# EAGLE design LED Breakout Board V8 (EAGLE 7.1.0)
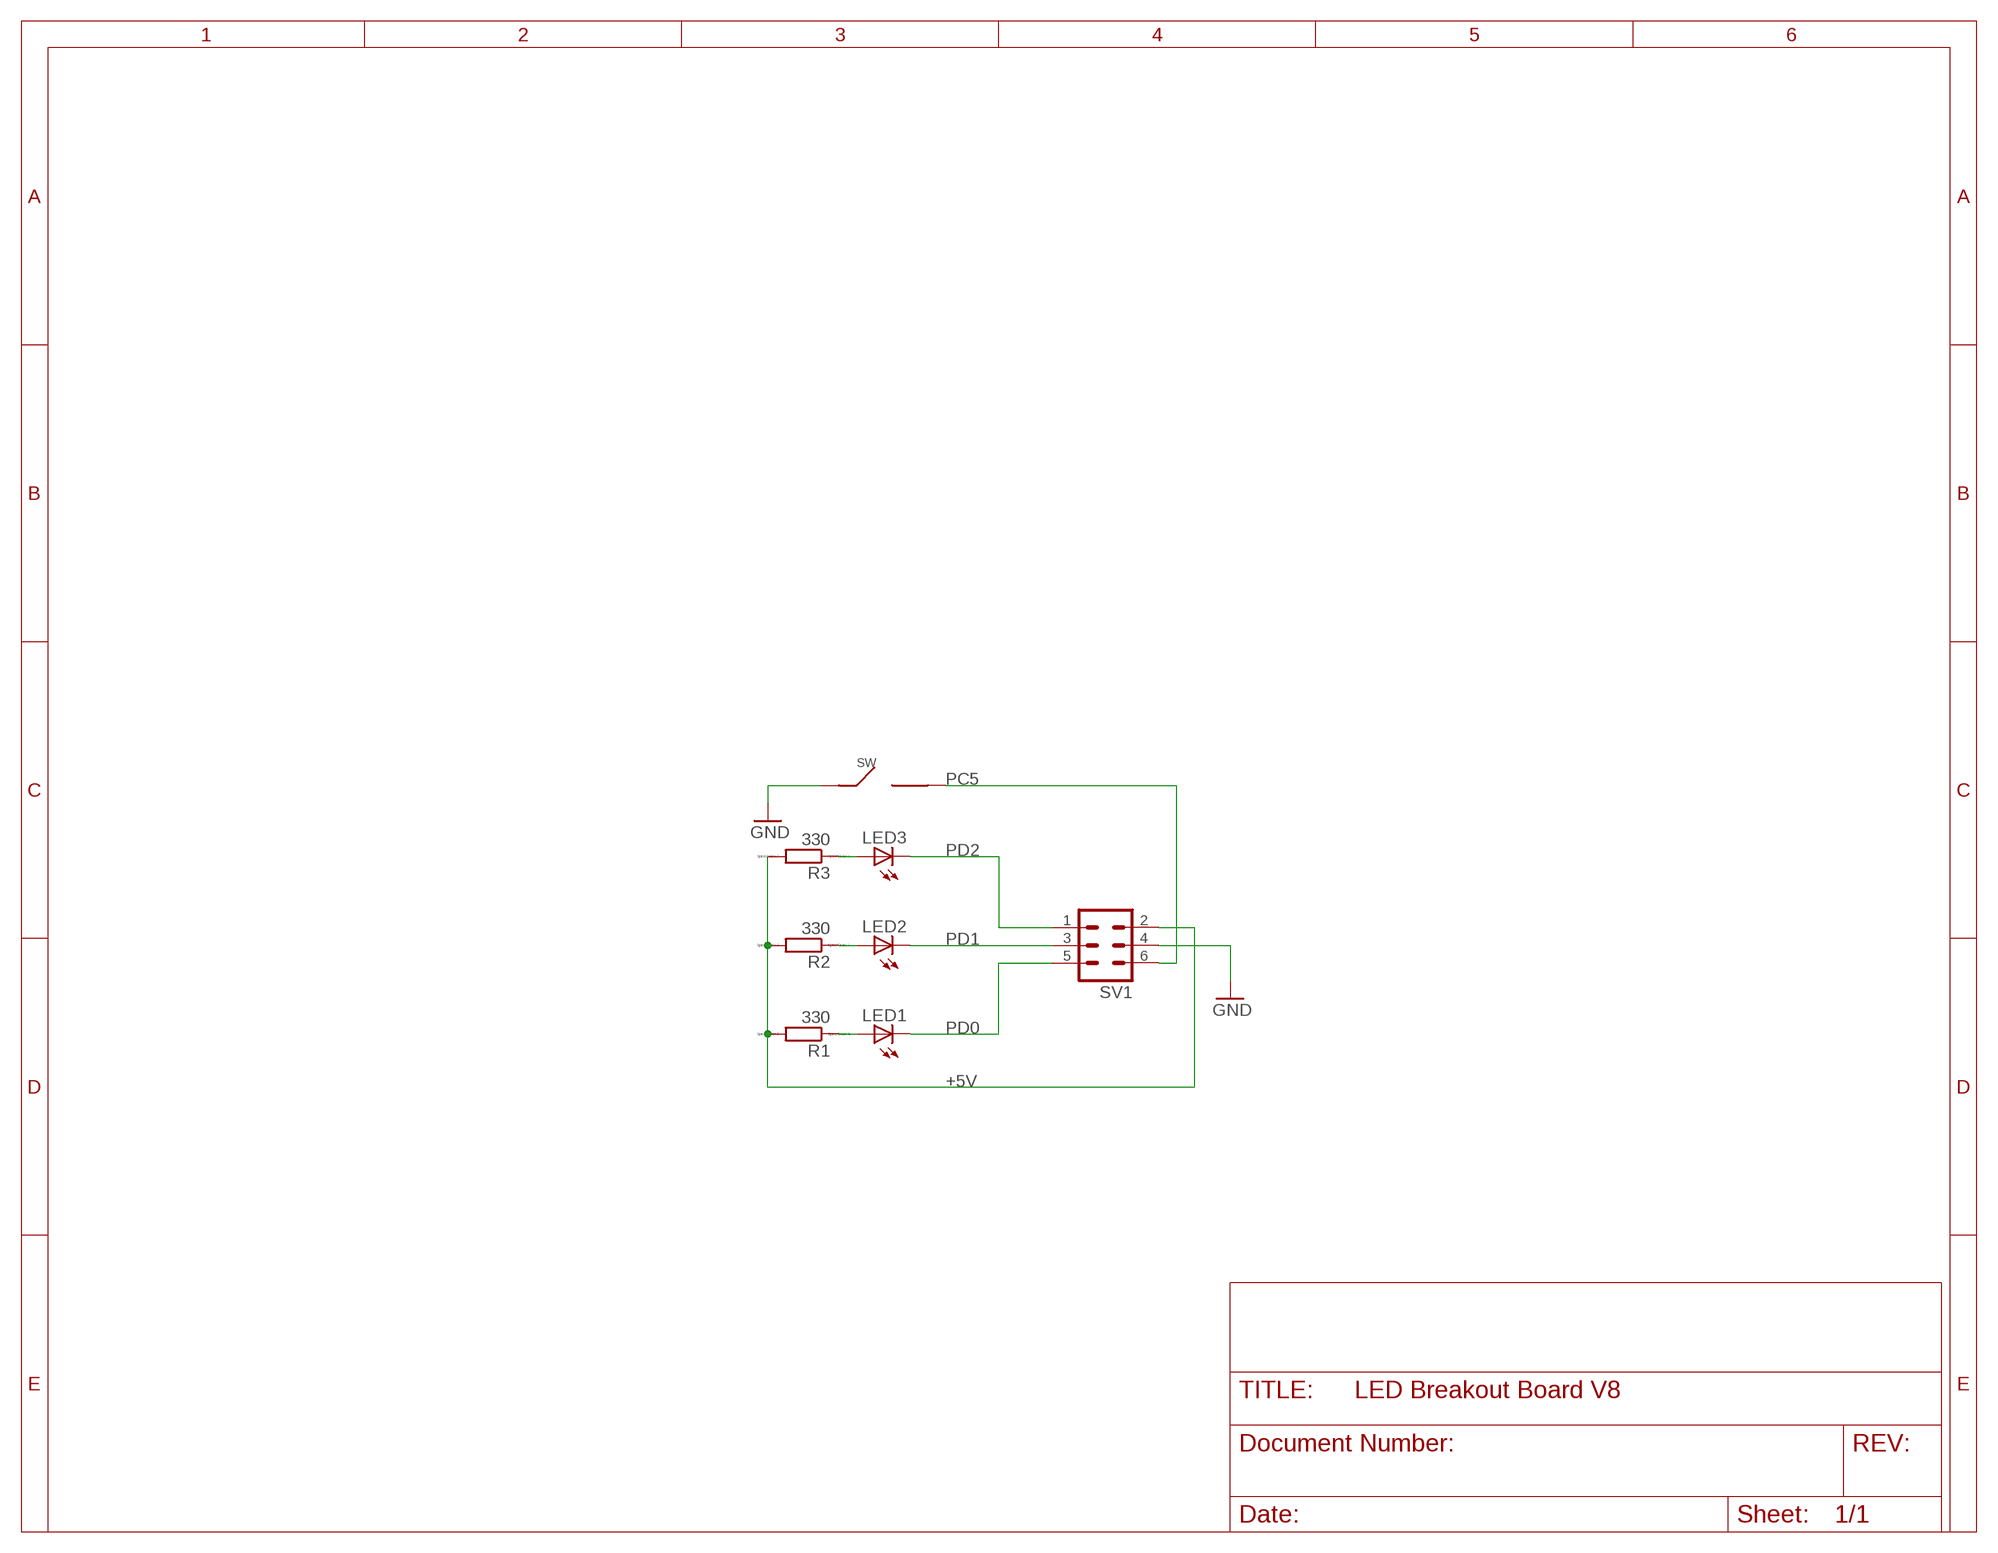
[diagram p0: schematic, sheet 1]

## Parts
LED1  LED10MM  [LED10MM]
LED2  LED10MM  [LED10MM]
LED3  LED10MM  [LED10MM]
R1  330  R0207/10  [0207/10]
R2  330  R0207/10  [0207/10]
R3  330  R0207/10  [0207/10]
SV1  MA03-2  [MA03-2]
SW  PUSHBUTTON  [PUSHBUTTON]

## Nets
+5V: R1.2 R2.2 R3.2 SV1.2
GND: SV1.4 SW.IN
N$2: LED3.A R3.1
N$3: LED2.A R2.1
N$4: LED1.A R1.1
PC5: SV1.6 SW.OUT
PD0: LED1.K(C) SV1.5
PD1: LED2.K(C) SV1.3
PD2: LED3.K(C) SV1.1

## Library data of the parts
LED1-LED3 = led:LED: LED OSRAM: - CHIPLED LG R971, LG N971, LY N971, LG Q971, LY Q971, LO R971, LY R971 LH N974, LH R974 LS Q976, LO Q976, LY Q976 LO Q996 - Hyper CHIPLED LW Q18S LB Q993, LB Q99A, LB R99A - SideLED LS A670, LO A670, LY A670, LG A670, LP A670 LB A673, LV A673, LT A673, LW A673 LH A674 LY A675 LS A676, LA A676, LO A676, LY A676, LW A676 LS A679, LY A679, LG A679 - Hyper Micro SIDELED® LS Y876, LA Y876, LO Y876, LY Y876 LT Y87S - SmartLED LW L88C, LW L88S LB L89C, LB L89S, LG L890 LS L89K, LO L89K, LY L89K LS L896, LA L896, LO L896, LY L896 - TOPLED LS T670, LO T670, LY T670, LG T670, LP T670 LSG T670, LSP T670, LSY T670, LOP T670, LYG T670 LG T671, LOG T671, LSG T671 LB T673, LV T673, LT T673, LW T673 LH T674 LS T676, LA T676, LO T676, LY T676, LB T676, LH T676, LSB T676, LW T676 LB T67C, LV T67C, LT T67C, LS T67K, LO T67K, LY T67K, LW E67C LS E67B, LA E67B, LO E67B, LY E67B, LB E67C, LV E67C, LT E67C LW T67C LS T679, LY T679, LG T679 LS T770, LO T770, LY T770, LG T770, LP T770 LB T773, LV T773, LT T773, LW T773 LH T774 LS E675, LA E675, LY E675, LS T675 LS T776, LA T776, LO T776, LY T776, LB T776 LHGB T686 LT T68C, LB T68C - Hyper Mini TOPLED® LB M676 - Mini TOPLED Santana® LG M470 LS M47K, LO M47K, LY M47K Source: http://www.osram.convergy.de LUXEON: - LUMILED® LXK2-PW12-R00, LXK2-PW12-S00, LXK2-PW14-U00, LXK2-PW14-V00 LXK2-PM12-R00, LXK2-PM12-S00, LXK2-PM14-U00 LXK2-PE12-Q00, LXK2-PE12-R00, LXK2-PE12-S00, LXK2-PE14-T00, LXK2-PE14-U00 LXK2-PB12-K00, LXK2-PB12-L00, LXK2-PB12-M00, LXK2-PB14-N00, LXK2-PB14-P00, LXK2-PB14-Q00 LXK2-PR12-L00, LXK2-PR12-M00, LXK2-PR14-Q00, LXK2-PR14-R00 LXK2-PD12-Q00, LXK2-PD12-R00, LXK2-PD12-S00 LXK2-PH12-R00, LXK2-PH12-S00 LXK2-PL12-P00, LXK2-PL12-Q00, LXK2-PL12-R00 Source: www.luxeon.com KINGBRIGHT: KA-3528ASYC Source: www.kingbright.com
R1-R3 = eagle-ltspice:R: RESISTOR, European symbol; SPICEMODEL: NONE; SPICEPREFIX: R
SV1 = con-lstb:MA03-2: PIN HEADER; OC_FARNELL: unknown; OC_NEWARK: unknown
SW = pushbutton:PUSHBUTTON

## Board
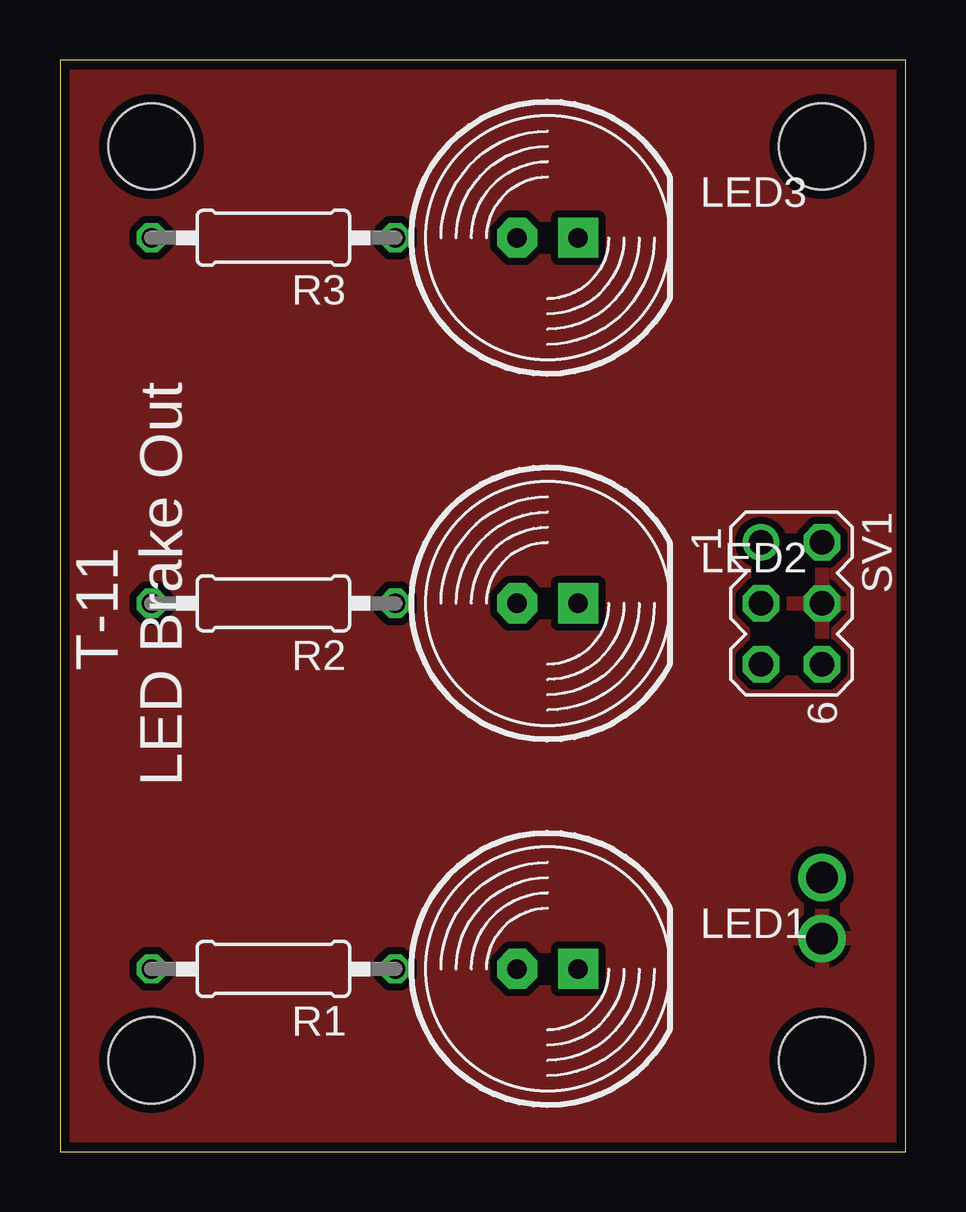
[diagram p1: board, top side]
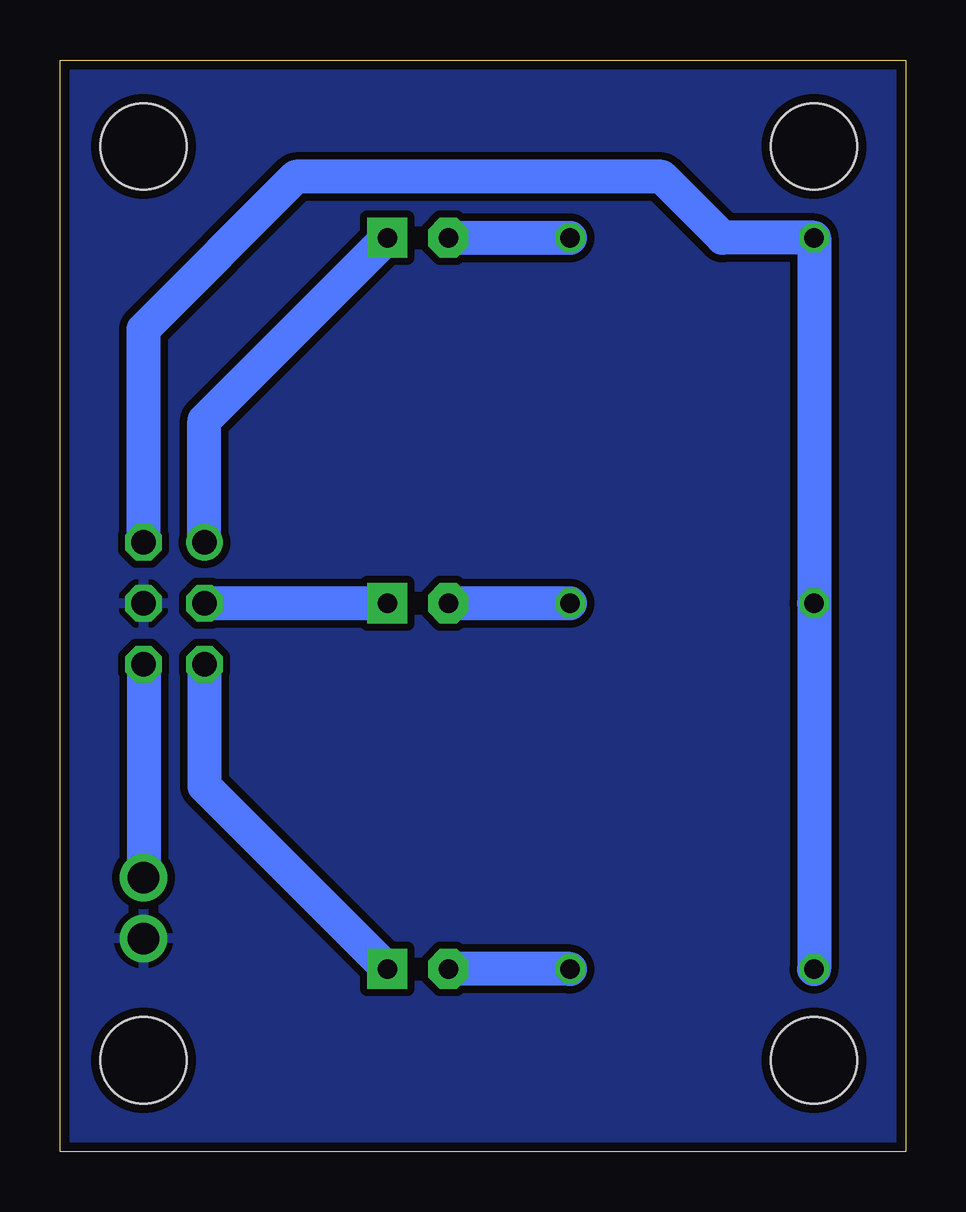
[diagram p2: board, bottom side, seen from below]

Size 35.23 x 45.51 mm. Coordinates in mm from the lower left corner, seen from the top.
Outline: 0,0 35.23,0 35.23,45.51 0,45.51 0,0
Copper layers (1*16): Top 0.0178mm / dielectric 59mil / Bottom 0.0178mm
Design rules "epl-lpkf": minimum track width 8mil, minimum drill 0.35mm, track to track 8mil, track to pad 8mil, pad to pad 8mil, via to via 8mil, smd to smd 8mil, copper to edge 15mil, drill to drill 15mil, minimum pad ring 8mil, minimum via ring 8mil, stop-mask expansion 3mil, vias tented up to drill 0mil, thermal gap 10mil
Holes 3.6 mm at 3.81,41.91 31.75,41.91 31.75,3.81 3.81,3.81

### Footprints (pad centres in the part's own frame; a part is rotated, then mirrored left to right if it is on the bottom)
LED10MM = drill 0.813 pad 1.676 octagon: A -1.27,0 | drill 0.813 pad 1.676 square: K 1.27,0
0207/10 = drill 0.813 octagon: 1 -5.08,0; 2 5.08,0
MA03-2 = drill 1.016: 1 -2.54,-1.27 | drill 1.016 octagon: 2 -2.54,1.27; 3 0,-1.27; 4 0,1.27; 5 2.54,-1.27; 6 2.54,1.27
PUSHBUTTON = drill 1.321: IN -1.27,0; OUT 1.27,0

### Placement (x,y rotation side)
LED1  20.32,7.62 0 top
LED2  20.32,22.86 0 top
LED3  20.32,38.1 0 top
R1  8.89,7.62 180 top
R2  8.89,22.86 180 top
R3  8.89,38.1 180 top
SV1  30.48,22.86 270 top
SW  31.75,10.16 90 top

### Tracks (layer width: path | path; a pad name or v marks a point on that pad's centre or on a via)
+5V
  Bottom 1.422: SV1.2 31.75,34.29 25.4,40.64 10.16,40.64 7.62,38.1 R3.2 R2.2 R1.2
GND
  pour Top (isolate 0.305): 0,45.85 34.79,46.05 34.79,0.11 0,-0.09
  pour Bottom (isolate 0.305): 0,45.72 35.56,45.72 35.56,0 0,0
N$2
  Bottom 1.422: LED3.A R3.1
N$3
  Bottom 1.422: R2.1 LED2.A
N$4
  Bottom 1.422: R1.1 LED1.A
PC5
  Bottom 1.422: SV1.6 SW.OUT
PD0
  Bottom 1.422: SV1.5 29.21,15.24 LED1.K
PD1
  Bottom 1.422: LED2.K SV1.3
PD2
  Bottom 1.422: SV1.1 29.21,30.48 LED3.K

### Text on the board
tNames: T-11 / LED Brake Out